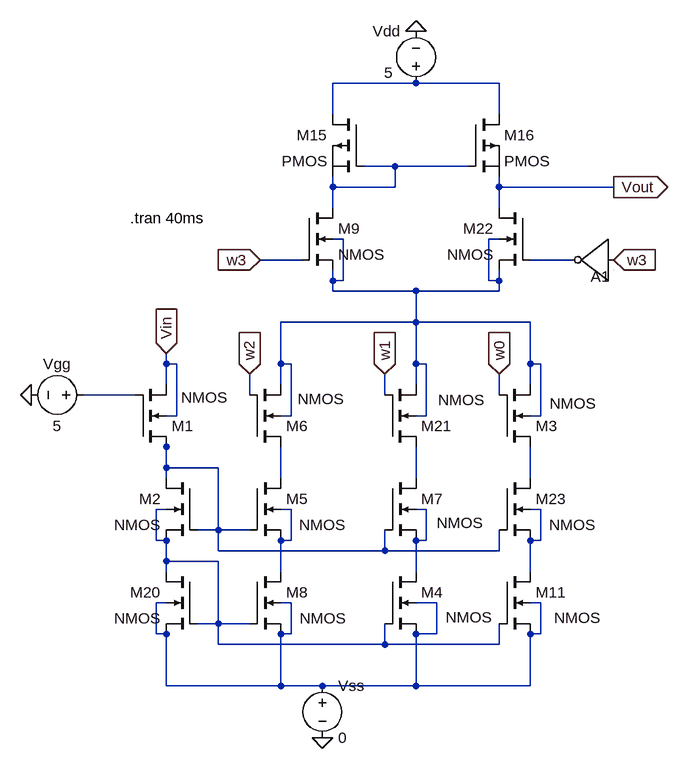
[diagram p0: schematic 4Bit_DACV3.asc]
4Bit_DACV3.asc, the LTspice schematic file:
Version 4
SHEET 1 1324 712
WIRE 384 -336 256 -336
WIRE 512 -336 384 -336
WIRE 256 -288 256 -336
WIRE 512 -288 512 -336
WIRE 352 -208 304 -208
WIRE 464 -208 352 -208
WIRE 256 -176 256 -192
WIRE 352 -176 352 -208
WIRE 352 -176 256 -176
WIRE 512 -176 512 -192
WIRE 688 -176 512 -176
WIRE 256 -144 256 -176
WIRE 512 -144 512 -176
WIRE 272 -96 256 -96
WIRE 512 -96 496 -96
WIRE 208 -64 144 -64
WIRE 624 -64 560 -64
WIRE 256 -32 256 -48
WIRE 272 -32 272 -96
WIRE 272 -32 256 -32
WIRE 496 -32 496 -96
WIRE 512 -32 512 -48
WIRE 512 -32 496 -32
WIRE 256 -16 256 -32
WIRE 384 -16 256 -16
WIRE 512 -16 512 -32
WIRE 512 -16 384 -16
WIRE 384 32 384 -16
WIRE 384 32 176 32
WIRE 560 32 384 32
WIRE 0 96 0 80
WIRE 16 96 0 96
WIRE 176 96 176 32
WIRE 192 96 176 96
WIRE 384 96 384 32
WIRE 400 96 384 96
WIRE 560 96 560 32
WIRE 576 96 560 96
WIRE 0 128 0 96
WIRE 176 128 176 96
WIRE 384 128 384 96
WIRE 560 128 560 96
WIRE -48 144 -128 144
WIRE 128 144 128 112
WIRE 336 144 336 112
WIRE 512 144 512 112
WIRE 16 176 16 96
WIRE 16 176 0 176
WIRE 192 176 192 96
WIRE 192 176 176 176
WIRE 400 176 400 96
WIRE 400 176 384 176
WIRE 576 176 576 96
WIRE 576 176 560 176
WIRE 0 224 0 208
WIRE 0 256 0 224
WIRE 80 256 0 256
WIRE 0 272 0 256
WIRE 176 272 176 224
WIRE 384 272 384 224
WIRE 560 272 560 224
WIRE 0 320 -16 320
WIRE 192 320 176 320
WIRE 400 320 384 320
WIRE 576 320 560 320
WIRE 80 352 80 256
WIRE 80 352 48 352
WIRE 128 352 80 352
WIRE -16 368 -16 320
WIRE 0 368 -16 368
WIRE 192 368 192 320
WIRE 192 368 176 368
WIRE 400 368 400 320
WIRE 400 368 384 368
WIRE 576 368 576 320
WIRE 576 368 560 368
WIRE 80 384 80 352
WIRE 336 384 336 352
WIRE 336 384 80 384
WIRE 512 384 512 352
WIRE 512 384 336 384
WIRE 0 400 0 368
WIRE 80 400 0 400
WIRE 0 416 0 400
WIRE 176 416 176 368
WIRE 384 416 384 368
WIRE 560 416 560 368
WIRE 0 464 -16 464
WIRE 192 464 176 464
WIRE 416 464 384 464
WIRE 576 464 560 464
WIRE 80 496 80 400
WIRE 80 496 48 496
WIRE 128 496 80 496
WIRE -16 512 -16 464
WIRE 0 512 -16 512
WIRE 192 512 192 464
WIRE 192 512 176 512
WIRE 416 512 416 464
WIRE 416 512 384 512
WIRE 576 512 576 464
WIRE 576 512 560 512
WIRE 80 528 80 496
WIRE 336 528 336 496
WIRE 336 528 80 528
WIRE 512 528 512 496
WIRE 512 528 336 528
WIRE 0 592 0 512
WIRE 176 592 176 512
WIRE 176 592 0 592
WIRE 240 592 176 592
WIRE 384 592 384 512
WIRE 384 592 240 592
WIRE 560 592 560 512
WIRE 560 592 384 592
FLAG 240 672 0
FLAG 384 -416 0
FLAG 688 -176 Vout
IOPIN 688 -176 Out
FLAG -208 144 0
FLAG 336 112 w1
IOPIN 336 112 In
FLAG 128 112 w2
IOPIN 128 112 In
FLAG 144 -64 w3
IOPIN 144 -64 In
FLAG 688 -64 w3
IOPIN 688 -64 In
FLAG 0 80 Vin
IOPIN 0 80 In
FLAG 512 112 w0
IOPIN 512 112 In
SYMBOL voltage 240 576 R0
WINDOW 123 0 0 Left 0
WINDOW 39 0 0 Left 0
SYMATTR InstName Vss
SYMATTR Value 0
SYMBOL voltage 384 -320 R180
WINDOW 0 24 96 Left 2
WINDOW 3 35 32 Left 2
WINDOW 123 0 0 Left 0
WINDOW 39 0 0 Left 0
SYMATTR InstName Vdd
SYMATTR Value 5
SYMBOL pmos 304 -288 M0
SYMATTR InstName M15
SYMBOL pmos 464 -288 R0
SYMATTR InstName M16
SYMBOL nmos4 512 416 R0
WINDOW 3 85 71 Left 2
SYMATTR InstName M11
SYMATTR Value2 l=10 w=100
SYMBOL nmos4 128 224 M180
WINDOW 3 74 74 Left 2
SYMATTR InstName M6
SYMATTR Value2 l=40 w=100
SYMBOL nmos4 336 272 R0
WINDOW 3 80 69 Left 2
SYMATTR InstName M7
SYMATTR Value2 l=20 w=100
SYMBOL nmos4 48 416 M0
SYMATTR InstName M20
SYMATTR Value2 l=10 w=100
SYMBOL nmos4 336 224 M180
WINDOW 3 82 72 Left 2
SYMATTR InstName M21
SYMATTR Value2 l=20 w=100
SYMBOL nmos4 560 -144 M0
SYMATTR InstName M22
SYMATTR Value2 l=10 w=100
SYMBOL nmos4 512 272 R0
WINDOW 3 77 72 Left 2
SYMATTR InstName M23
SYMATTR Value2 l=10 w=100
SYMBOL nmos4 336 416 R0
WINDOW 3 94 70 Left 2
SYMATTR InstName M4
SYMATTR Value2 l=20 w=100
SYMBOL nmos4 128 272 R0
WINDOW 3 76 72 Left 2
SYMATTR InstName M5
SYMATTR Value2 l=40 w=100
SYMBOL nmos4 128 416 R0
WINDOW 3 77 72 Left 2
SYMATTR InstName M8
SYMATTR Value2 l=40 w=100
SYMBOL nmos4 48 272 M0
SYMATTR InstName M2
SYMATTR Value2 l=10 w=100
SYMBOL voltage -112 144 R90
WINDOW 0 -32 56 VBottom 2
WINDOW 3 32 56 VTop 2
WINDOW 123 0 0 Left 0
WINDOW 39 0 0 Left 0
SYMATTR InstName Vgg
SYMATTR Value 5
SYMBOL Digital\\inv 688 -128 M0
WINDOW 0 6 90 Left 2
SYMATTR InstName A1
SYMBOL nmos4 512 224 M180
WINDOW 3 78 67 Left 2
SYMATTR InstName M3
SYMATTR Value2 l=10 w=100
SYMBOL nmos4 208 -144 R0
SYMATTR InstName M9
SYMATTR Value2 l=10 w=100
SYMBOL nmos4 -48 224 M180
WINDOW 3 71 76 Left 2
SYMATTR InstName M1
SYMATTR Value2 l=10 w=100
TEXT -56 -128 Left 2 !.tran 40ms

The netlist it stands for:
* 4Bit_DACV3.asc
Vss N014 0 0
Vdd N001 0 5
M15 N001 N002 N002 N002 PMOS
M16 N001 N002 Vout Vout PMOS
M11 N013 N010 N014 N014 NMOS l=10 w=100
M6 N007 w2 N003 N003 NMOS l=40 w=100
M7 N008 N006 N012 N012 NMOS l=20 w=100
M20 N010 N010 N014 N014 NMOS l=10 w=100
M21 N008 w1 N003 N003 NMOS l=20 w=100
M22 Vout N004 N003 N003 NMOS l=10 w=100
M23 N009 N006 N013 N013 NMOS l=10 w=100
M4 N012 N010 N014 N014 NMOS l=20 w=100
M5 N007 N006 N011 N011 NMOS l=40 w=100
M8 N011 N010 N014 N014 NMOS l=40 w=100
M2 N006 N006 N010 N010 NMOS l=10 w=100
Vgg N005 0 5
A1 w3 0 0 0 0 N004 0 0 BUF
M3 N009 w0 N003 N003 NMOS l=10 w=100
M9 N002 w3 N003 N003 NMOS l=10 w=100
M1 N006 N005 Vin Vin NMOS l=10 w=100
.model NMOS NMOS
.model PMOS PMOS
.lib standard.mos
.tran 40ms
.backanno
.end